# Altium schematic sheet power.SchDoc
size A
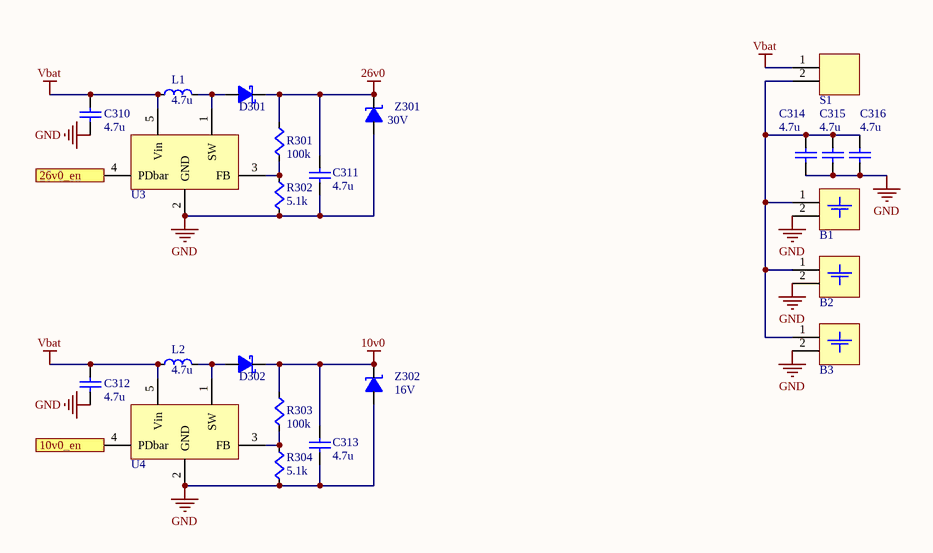
[diagram p0: power.SchDoc]

## Parts
B1  Batt  [batt_pads]  (value not drawn)
B2  Batt  [batt_pads]  (value not drawn)
B3  Batt  [batt_pads]  (value not drawn)
C310  value 4.7u  [SMD0603_cap]  (hidden comment: Cap)
C311  value 4.7u  [SMD0603_cap]  (hidden comment: Cap)
C312  value 4.7u  [SMD0603_cap]  (hidden comment: Cap)
C313  value 4.7u  [SMD0603_cap]  (hidden comment: Cap)
C314  value 4.7u  [SMD0603_cap]  (hidden comment: Cap)
C315  value 4.7u  [SMD0603_cap]  (hidden comment: Cap)
C316  value 4.7u  [SMD0603_cap]  (hidden comment: Cap)
D301  Shottky  [sod-323f]  (value not drawn)
D302  Shottky  [sod-323f]  (value not drawn)
L1  value 4.7u  [smd_0806]  (hidden comment: Inductor)
L2  value 4.7u  [smd_0806]  (hidden comment: Inductor)
R301  value 100k  [SMD0603]  (hidden comment: Res)
R302  value 5.1k  [SMD0603]  (hidden comment: Res)
R303  value 100k  [SMD0603]  (hidden comment: Res)
R304  value 5.1k  [SMD0603]  (hidden comment: Res)
S1  Header_smd-2x1  [header_smd-2x1]  (value not drawn)
U3  AP3012  [SOT23-5Lead]  (value not drawn)
U4  AP3012  [SOT23-5Lead]  (value not drawn)
Z301  value 30V  [SOD-323F]  (hidden comment: Zener)
Z302  value 16V  [SOD-323F]  (hidden comment: Zener)

## Ports
10v0_en (in), 26v0_en (in)

## Nets
10v0: C313.2 D302.K R303.2 Z302.K
26v0: C311.2 D301.K R301.2 Z301.K
GND: B1.2 B2.2 B3.2 C310.1 C311.1 C312.1 C313.1 C314.1 C315.1 C316.1 R302.1 R304.1 U3.2(GND) U4.2(GND) Z301.A Z302.A
Vbat: C310.2 C312.2 L1.1(Source) L2.1(Source) S1.1 U3.5(Vin) U4.5(Vin)
10v0_en: U4.4(PDbar) ; port 10v0_en
26v0_en: U3.4(PDbar) ; port 26v0_en
NetB1_1: B1.1 B2.1 B3.1 C314.2 C315.2 C316.2 S1.2
NetD301_A: D301.A L1.2(Source) U3.1(SW)
NetD302_A: D302.A L2.2(Source) U4.1(SW)
NetR301_1: R301.1 R302.2 U3.3(FB)
NetR303_1: R303.1 R304.2 U4.3(FB)

## Library data of the parts
C310-C316 = Capacitor Ceramic: Ceramic Chip Capacitor
L1 L2 = Inductor: Code_IEC: 1005; Published: 8-Jun-2000; LatestRevisionDate: 29-May-2009; LatestRevisionNote: IPC-7351 Footprint Added.; PackageReference: 0402-A; Publisher: Altium Limited; PackageDescription: Chip Inductor; Code_JEITA: 0402
R301-R304 = Resistor